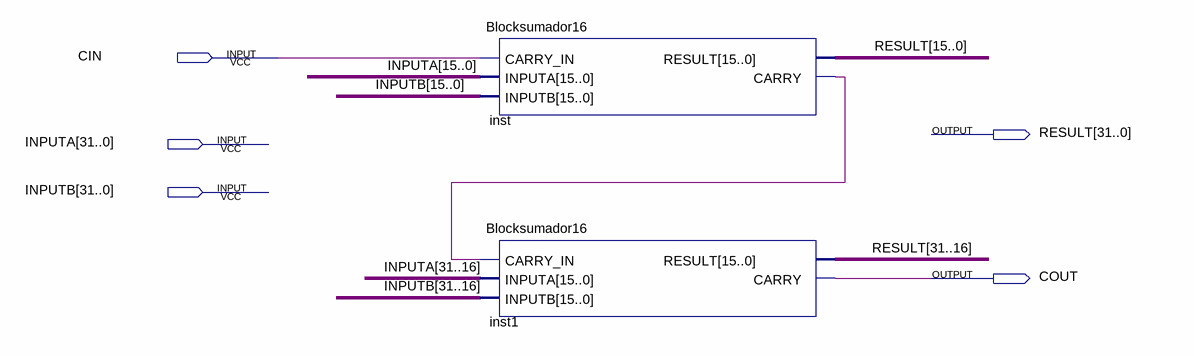
[diagram p0: schematic sheet]
// Quartus schematic SUMADOR32.bdf as structural Verilog: 2 symbols, 5 pins
module SUMADOR32 (
  input  CIN,
  input  [31:0] INPUTA,
  input  [31:0] INPUTB,
  output [31:0] RESULT,
  output COUT
);

  wire inst_carry;

  Blocksumador16 inst (
    .CARRY_IN(CIN), .INPUTA(INPUTA[15:0]), .INPUTB(INPUTB[15:0]), .RESULT(RESULT[15:0]), .CARRY(inst_carry));
  Blocksumador16 inst1 (
    .CARRY_IN(inst_carry), .INPUTA(INPUTA[31:16]), .INPUTB(INPUTB[31:16]), .RESULT(RESULT[31:16]),
    .CARRY(COUT));
endmodule
